# Altium schematic sheet power_supply.SchDoc
size A4
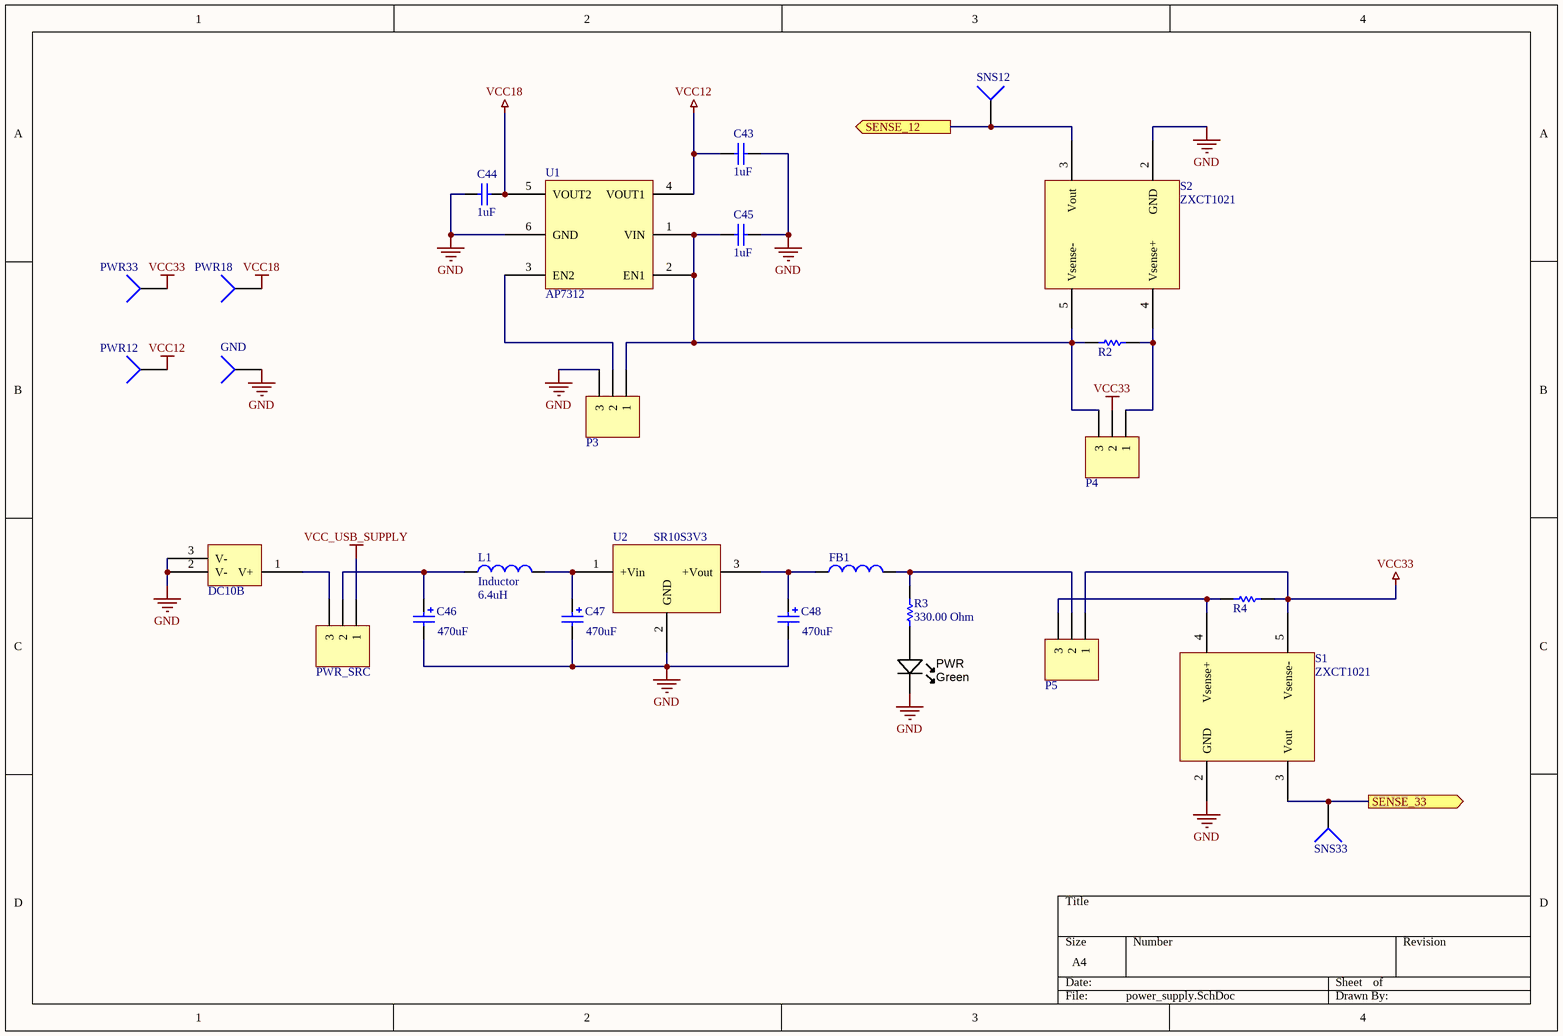
[diagram p0: power_supply.SchDoc]

## Parts
C43  1uF  [CAPC0805(2012)100_N]
C44  1uF  [CAPC0805(2012)100_N]
C45  1uF  [CAPC0805(2012)100_N]
C46  value 470uF  [CAP470uF]  (hidden comment: Cap Pol2)
C47  value 470uF  [CAP470uF]  (hidden comment: Cap Pol2)
C48  value 470uF  [CAP470uF]  (hidden comment: Cap Pol2)
FB1  Inductor  [INDC3216]  (value not drawn)
GND  Socket  [PIN1]  (value not drawn)
L1  Inductor  value 6.4uH  [Coil DRA74-6R8-R]
P3  Header 3  [HDR1X3]  (value not drawn)
P4  Header 3  [HDR1X3]  (value not drawn)
P5  Header 3  [HDR1X3]  (value not drawn)
PWR  Green  [LED-0805-K]
PWR12  Socket  [PIN1]  (value not drawn)
PWR18  Socket  [PIN1]  (value not drawn)
PWR33  Socket  [PIN1]  (value not drawn)
PWR_SRC  Header 3  [HDR1X3]  (value not drawn)
PWRCON  DC10B  [DC-10B]
R2  10R 5% 0805(2012)  [RESC0805(2012)_L]  (value not drawn)
R3  330.00 Ohm  [RESC0805(2012)_M]
R4  10R 5% 0805(2012)  [RESC0805(2012)_L]  (value not drawn)
S1  ZXCT1021  [SOT95P270X145-5N]
S2  ZXCT1021  [SOT95P270X145-5N]
SNS12  Socket  [PIN1]  (value not drawn)
SNS33  Socket  [PIN1]  (value not drawn)
U1  AP7312  [SOT95P285X145-6N]
U2  SR10S3V3  [SR10S3V3_Footprint]

## Ports
SENSE_12 (out), SENSE_33 (out)

## Nets
GND: C43.2 C44.1 C45.2 C46.2 C47.2 C48.2 GND.1 P3.3 PWR.K PWRCON.2(V-) PWRCON.3(V-) S1.2(GND) S2.2(GND) U1.6(GND) U2.2(GND)
VCC12: C43.1 PWR12.1 U1.4(VOUT1)
VCC18: C44.2 PWR18.1 U1.5(VOUT2)
VCC33: P4.2 P5.1 PWR33.1 R4.2 S1.5(Vsense-)
VCC_USB_SUPPLY: PWR_SRC.1
SENSE_12: S2.3(Vout) SNS12.1 ; port SENSE_12
SENSE_33: S1.3(Vout) SNS33.1 ; port SENSE_33
NetC45_1: C45.1 P3.1 P4.3 R2.1 S2.5(Vsense-) U1.1(VIN) U1.2(EN1)
NetC46_1: C46.1 L1.1 PWR_SRC.2
NetC47_1: C47.1 L1.2 U2.1(+Vin)
NetC48_1: C48.1 FB1.1 U2.3(+Vout)
NetFB1_2: FB1.2 P5.2 R3.2
NetP3_2: P3.2 U1.3(EN2)
NetP4_1: P4.1 R2.2 S2.4(Vsense+)
NetP5_3: P5.3 R4.1 S1.4(Vsense+)
NetPWR_A: PWR.A R3.1
NetPWR_SRC_3: PWR_SRC.3 PWRCON.1(V+)

## Library data of the parts
C43-C45 = CMP-1036-04747-1: CAP 1uF 16V ±10% 0805 (2012 Metric) Thickness 1mm SMD; Case-Metric: 2012; Case-EIA: 0805; Tolerance: ±10%; Technology: SMT; Value: 1uF; Rated Voltage: 16 V; Max Thickness: 1 mm
C46-C48 = Cap Pol2: Polarized Capacitor (Axial); Published: 8-Jun-2000; LatestRevisionDate: 17-Jul-2002; LatestRevisionNote: Re-released for DXP Platform.; PackageReference: POLAR0.8; Publisher: Altium Limited; PackageDescription: Polarized Capacitor; 2 Leads
FB1 = Inductor: Value: 10mH; Code_IEC: 1005; Published: 8-Jun-2000; LatestRevisionDate: 29-May-2009; LatestRevisionNote: IPC-7351 Footprint Added.; PackageReference: 0402-A; Publisher: Altium Limited; PackageDescription: Chip Inductor; Code_JEITA: 0402
L1 = Inductor: Code_IEC: 1005; Published: 8-Jun-2000; LatestRevisionDate: 29-May-2009; LatestRevisionNote: IPC-7351 Footprint Added.; PackageReference: 0402-A; Publisher: Altium Limited; PackageDescription: Chip Inductor; Code_JEITA: 0402
P3-P5 PWR_SRC = Header 3: Header, 3-Pin; LatestRevisionDate: 17-Jul-2002; LatestRevisionNote: Re-released for DXP Platform.; Publisher: Altium Limited
PWR = LED_SMD_Green_0805: LED, 0805 SMD, Green; Manufacturer 1: Ligitek; Manufacturer Part Number 1: LG170G-CT; Ratings: 10 mcd; 573 nm; Package / Case: 0805; Material: GaP
R2 R4 = CMP-1013-00026-1: 10R 0.125W 5% 0805 (2012 Metric)  SMD; Value: 10.00 Ohm; Case-EIA: 0805; Case-Metric: 2012; Technology: SMT; Power: 0.125 W; Tolerance: 5 %
R3 = CMP-1013-00454-1: 330R 0.125W 1% 0805 (2012 Metric)  SMD; Case-EIA: 0805; Case-Metric: 2012; Value: 330.00 Ohm; Power: 0.125 W; Tolerance: 1 %; Technology: SMT
GND PWR12 PWR18 PWR33 SNS12 SNS33 = Socket: LatestRevisionDate: 17-Jul-2002; LatestRevisionNote: Re-released for DXP Platform.; Publisher: Altium Limited